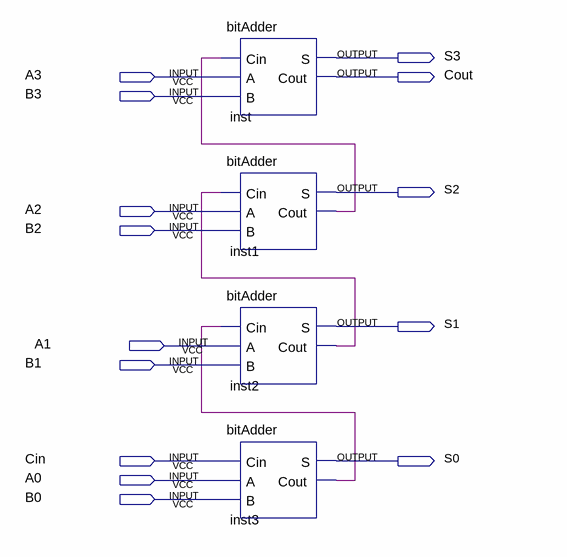
[diagram p0: schematic sheet]
// Quartus schematic nibbleAdder.bdf as structural Verilog: 4 symbols, 14 pins
module nibbleAdder (
  input  A3,
  input  B3,
  input  A2,
  input  B2,
  input  A1,
  input  B1,
  input  Cin,
  input  A0,
  input  B0,
  output S3,
  output Cout,
  output S2,
  output S1,
  output S0
);

  wire inst1_cout, inst2_cout, inst3_cout;

  bitAdder inst (.Cin(inst1_cout), .A(A3), .B(B3), .S(S3), .Cout(Cout));
  bitAdder inst1 (.Cin(inst2_cout), .A(A2), .B(B2), .S(S2), .Cout(inst1_cout));
  bitAdder inst2 (.Cin(inst3_cout), .A(A1), .B(B1), .S(S1), .Cout(inst2_cout));
  bitAdder inst3 (.Cin(Cin), .A(A0), .B(B0), .S(S0), .Cout(inst3_cout));
endmodule
